# EAGLE design M208X (EAGLE 6.6.0)
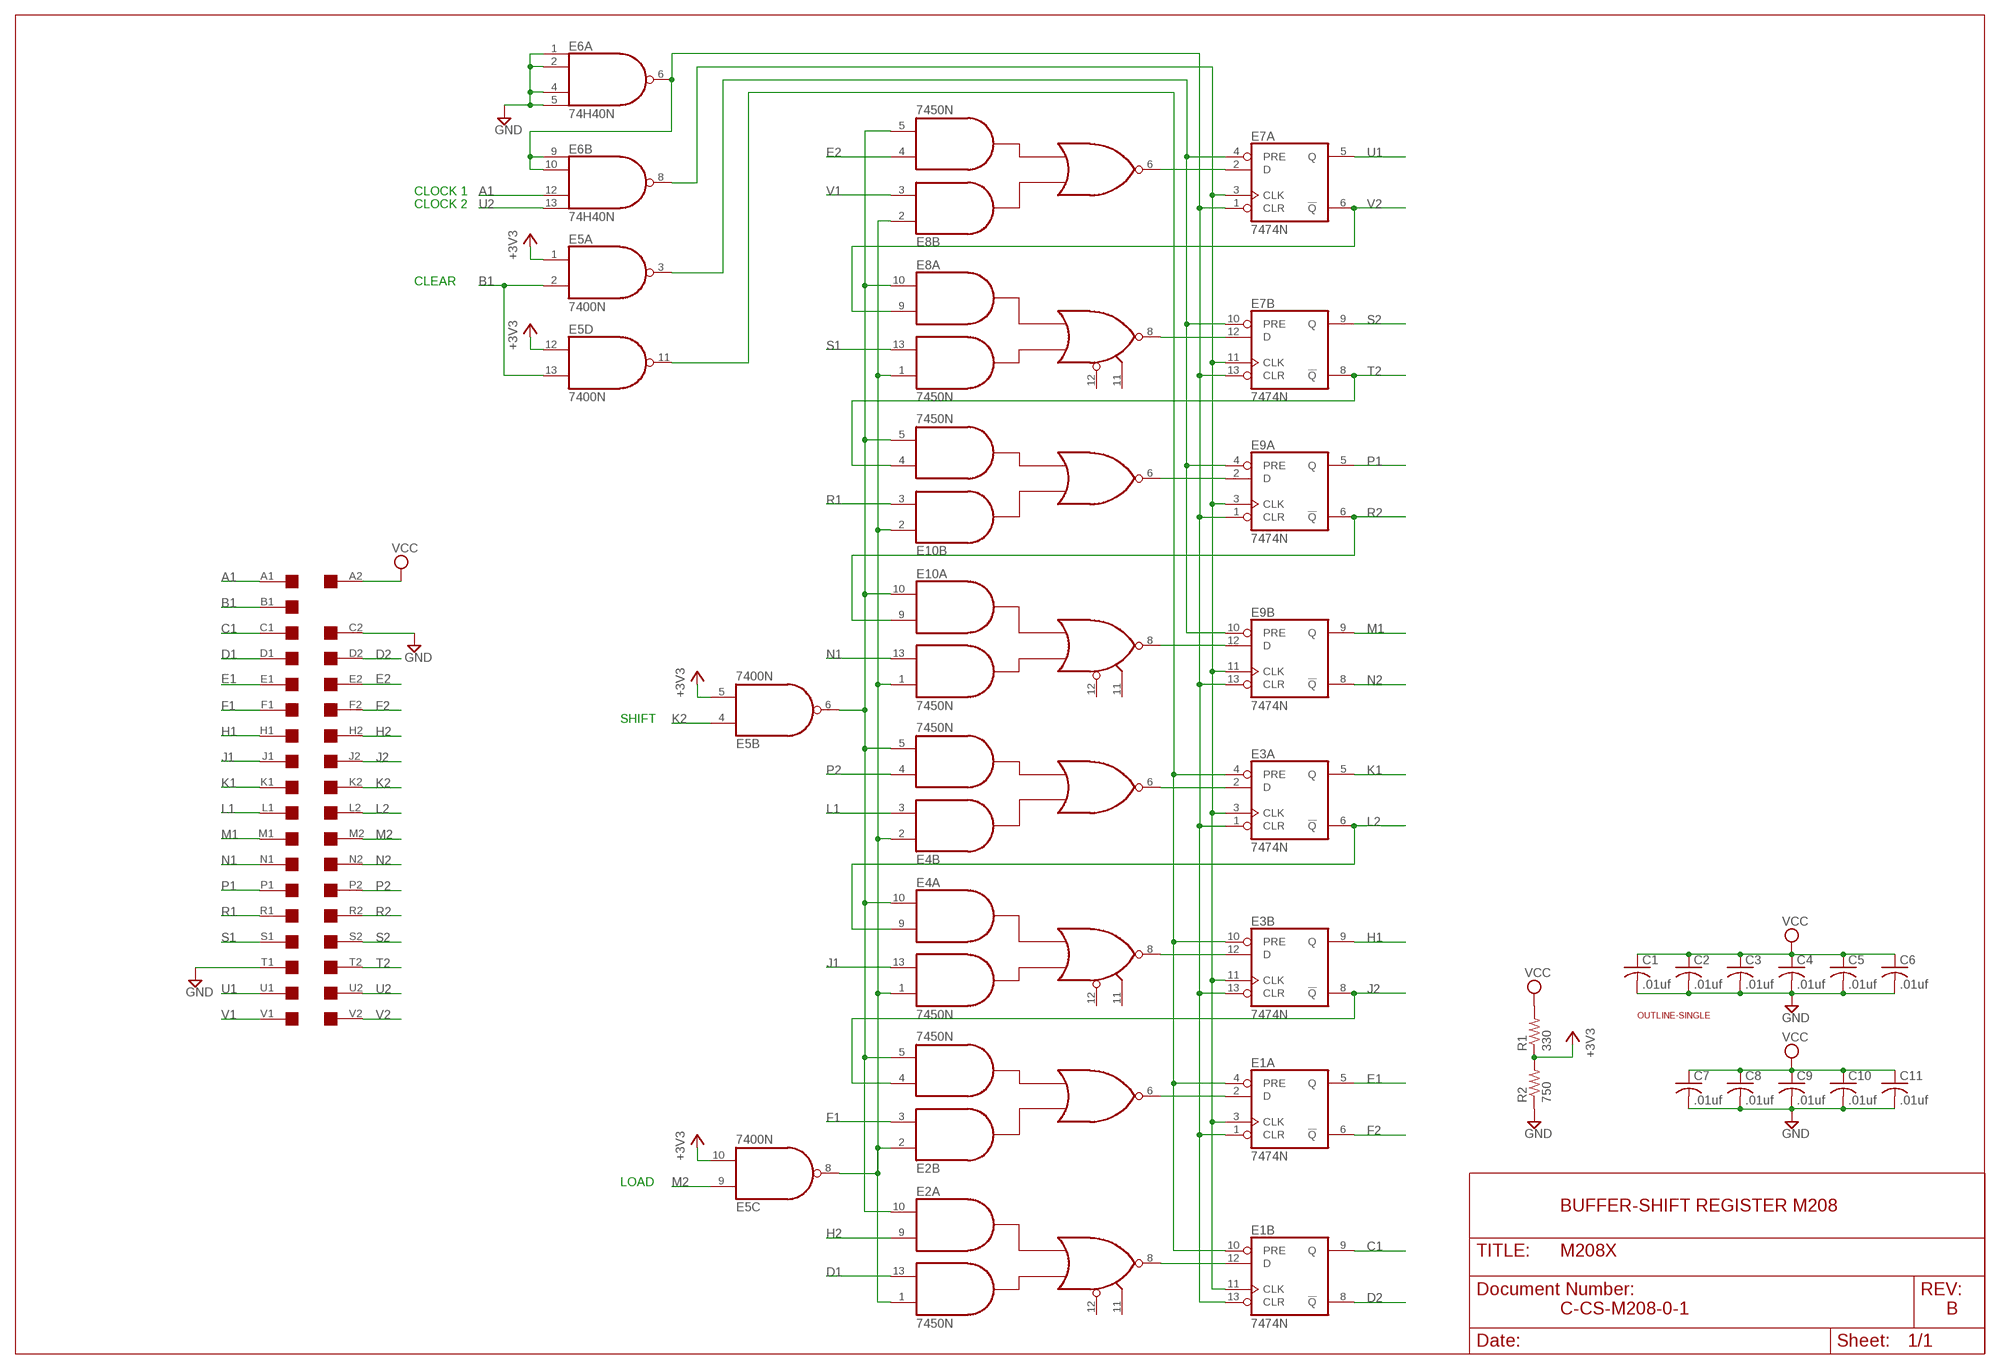
[diagram p0: schematic, sheet 1]

## Parts
C1  .01uf  C-US050-025X075  [C050-025X075]
C2  .01uf  C-US050-025X075  [C050-025X075]
C3  .01uf  C-US050-025X075  [C050-025X075]
C4  .01uf  C-US050-025X075  [C050-025X075]
C5  .01uf  C-US050-025X075  [C050-025X075]
C6  .01uf  C-US050-025X075  [C050-025X075]
C7  .01uf  C-US050-025X075  [C050-025X075]
C8  .01uf  C-US050-025X075  [C050-025X075]
C9  .01uf  C-US050-025X075  [C050-025X075]
C10  .01uf  C-US050-025X075  [C050-025X075]
C11  .01uf  C-US050-025X075  [C050-025X075]
E1  7474N  74S74N  [DIL14]
E2  7450N  [DIL14]
E3  7474N  74S74N  [DIL14]
E4  7450N  [DIL14]
E5  7400N  [DIL14]
E6  74H40N  74S20N  [DIL14]
E7  7474N  74S74N  [DIL14]
E8  7450N  [DIL14]
E9  7474N  74S74N  [DIL14]
E10  7450N  [DIL14]
R1  330  R-US_0207/10  [0207/10]
R2  750  R-US_0207/10  [0207/10]
U$1  SINGLE  [EDGE-CON2]
U$4  OUTLINE-SINGLE  [SINGLE]

## Nets
+3V3: E5.1(A:I0) E5.5(B:I1) E5.10(C:I1) E5.12(D:I0) R1.1 R2.2
A1: E6.12(B:I2) U$1.A1
B1: E5.2(A:I1) E5.13(D:I1) U$1.B1
C1: E1.9(B:Q) U$1.C1
D1: E2.13(A:I3) U$1.D1
D2: E1.8(B:!Q) U$1.D2
E1: E1.5(A:Q) U$1.E1
E2: E8.4(B:I3) U$1.E2
F1: E2.3(B:I2) U$1.F1
F2: E1.6(A:!Q) U$1.F2
GND [Supply]: C1.2 C2.2 C3.2 C4.2 C5.2 C6.2 C7.2 C8.2 C9.2 C10.2 C11.2 E6.1(A:I0) E6.2(A:I1) E6.4(A:I2) E6.5(A:I3) R2.1 U$1.C2 U$1.T1
H1: E3.9(B:Q) U$1.H1
H2: E2.9(A:I2) U$1.H2
J1: E4.13(A:I3) U$1.J1
J2: E2.4(B:I3) E3.8(B:!Q) U$1.J2
K1: E3.5(A:Q) U$1.K1
K2: E5.4(B:I0) U$1.K2
L1: E4.3(B:I2) U$1.L1
L2: E3.6(A:!Q) E4.9(A:I2) U$1.L2
M1: E9.9(B:Q) U$1.M1
M2: E5.9(C:I0) U$1.M2
N1: E10.13(A:I3) U$1.N1
N2: E9.8(B:!Q) U$1.N2
N$1: E7.2(A:D) E8.6(B:O)
N$2: E7.12(B:D) E8.8(A:O)
N$3: E9.2(A:D) E10.6(B:O)
N$4: E9.12(B:D) E10.8(A:O)
N$5: E3.2(A:D) E4.6(B:O)
N$6: E3.12(B:D) E4.8(A:O)
N$7: E1.2(A:D) E2.6(B:O)
N$8: E1.12(B:D) E2.8(A:O)
N$9: E2.1(A:I4) E2.2(B:I1) E4.1(A:I4) E4.2(B:I1) E5.8(C:O) E8.1(A:I4) E8.2(B:I1) E10.1(A:I4) E10.2(B:I1)
N$14: E2.5(B:I4) E2.10(A:I1) E4.5(B:I4) E4.10(A:I1) E5.6(B:O) E8.5(B:I4) E8.10(A:I1) E10.5(B:I4) E10.10(A:I1)
N$27: E1.3(A:CLK) E1.11(B:CLK) E3.3(A:CLK) E3.11(B:CLK) E6.8(B:O) E7.3(A:CLK) E7.11(B:CLK) E9.3(A:CLK) E9.11(B:CLK)
N$29: E1.1(A:CLR) E1.13(B:CLR) E3.1(A:CLR) E3.13(B:CLR) E6.6(A:O) E6.9(B:I0) E6.10(B:I1) E7.1(A:CLR) E7.13(B:CLR) E9.1(A:CLR) E9.13(B:CLR)
N$31: E5.3(A:O) E7.4(A:PRE) E7.10(B:PRE) E9.4(A:PRE) E9.10(B:PRE)
N$32: E1.4(A:PRE) E1.10(B:PRE) E3.4(A:PRE) E3.10(B:PRE) E5.11(D:O)
P1: E9.5(A:Q) U$1.P1
P2: E4.4(B:I3) U$1.P2
R1: E10.3(B:I2) U$1.R1
R2: E9.6(A:!Q) E10.9(A:I2) U$1.R2
S1: E8.13(A:I3) U$1.S1
S2: E7.9(B:Q) U$1.S2
T2: E7.8(B:!Q) E10.4(B:I3) U$1.T2
U1: E7.5(A:Q) U$1.U1
U2: E6.13(B:I3) U$1.U2
V1: E8.3(B:I2) U$1.V1
V2: E7.6(A:!Q) E8.9(A:I2) U$1.V2
VCC [Supply]: C1.1 C2.1 C3.1 C4.1 C5.1 C6.1 C7.1 C8.1 C9.1 C10.1 C11.1 R1.2 U$1.A2
Unconnected: E2.11(A:I6) E2.12(A:I5) E4.11(A:I6) E4.12(A:I5) E8.11(A:I6) E8.12(A:I5) E10.11(A:I6) E10.12(A:I5) U$1.B2

## Notes on the sheet
- CLOCK 1
- CLOCK 2
- CLEAR
- SHIFT
- LOAD
- BUFFER-SHIFT REGISTER M208
- C-CS-M208-0-1 | B

## Power pins joined to a net without a drawn wire
GND: E1.7(P:GND) E2.7(P:GND) E3.7(P:GND) E4.7(P:GND) E5.7(P:GND) E6.7(P:GND) E7.7(P:GND) E8.7(P:GND) E9.7(P:GND) E10.7(P:GND)
VCC: E1.14(P:VCC) E2.14(P:VCC) E3.14(P:VCC) E4.14(P:VCC) E5.14(P:VCC) E6.14(P:VCC) E7.14(P:VCC) E8.14(P:VCC) E9.14(P:VCC) E10.14(P:VCC)

## Library data of the parts
C1-C11 = rcl:C-US: CAPACITOR, American symbol
E1 E3 E7 E9 = 74xx-us:74*74: Dual D type positive edge triggered FLIP FLOP, preset and clear
E2 E4 E8 E10 = dec-con:74*50: 4-2-3-2 input AND OR INVERTER gates
E5 = 74xx-us:74*00: Quad 2-input NAND gate
E6 = 74xx-us:74*20: Dual 4-input NAND gate
R1 R2 = rcl:R-US_: RESISTOR, American symbol
U$1 = dec-con:SINGLE: Single-Height DEC board
U$4 = dec-con:OUTLINE-*: Board outlines for DEC boards.

## Net classes
1 Supply: width 0.813 mm

## Board
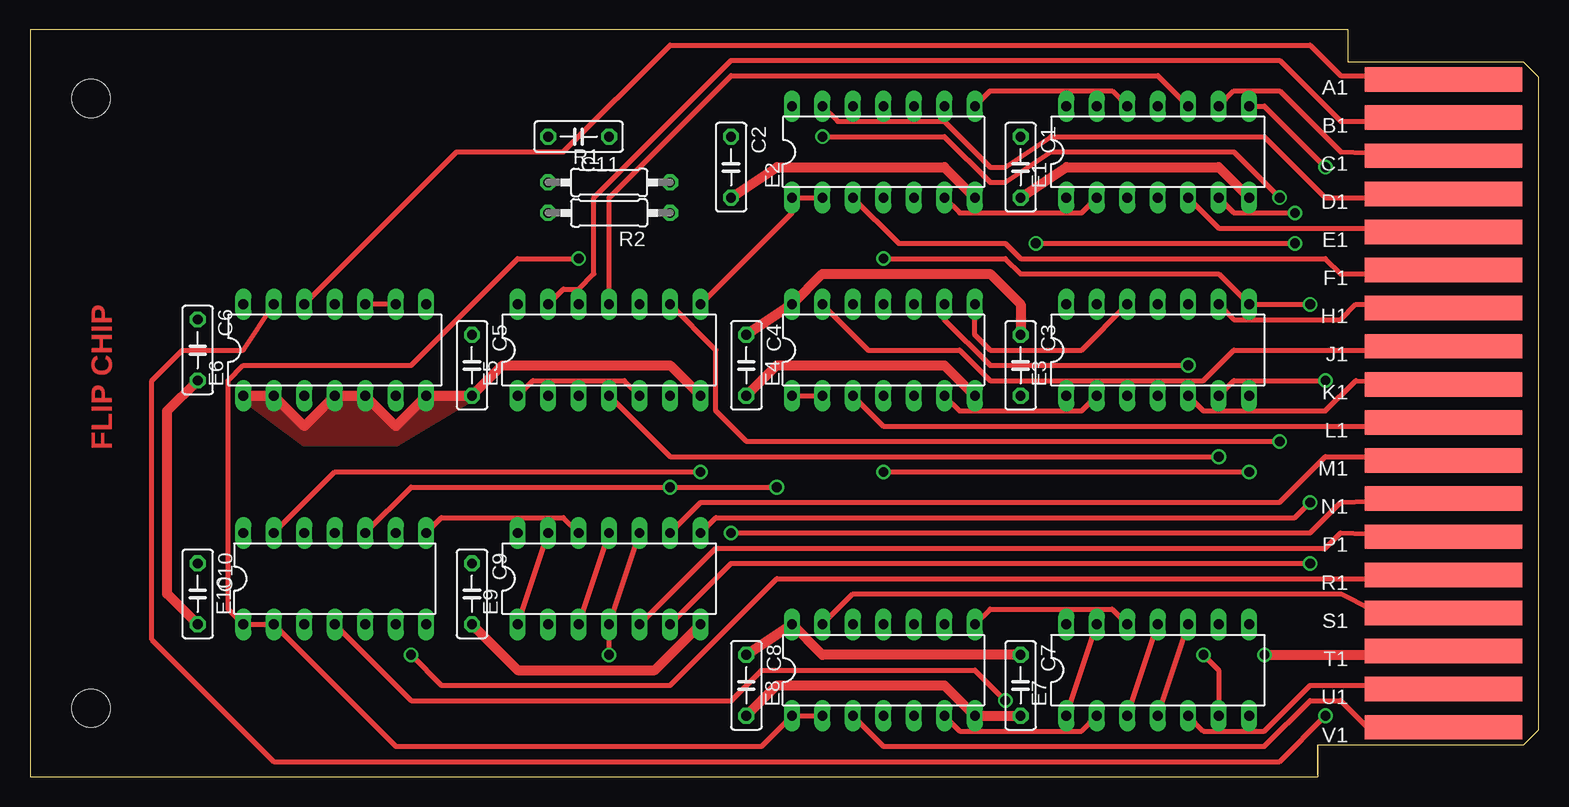
[diagram p1: board, top side]
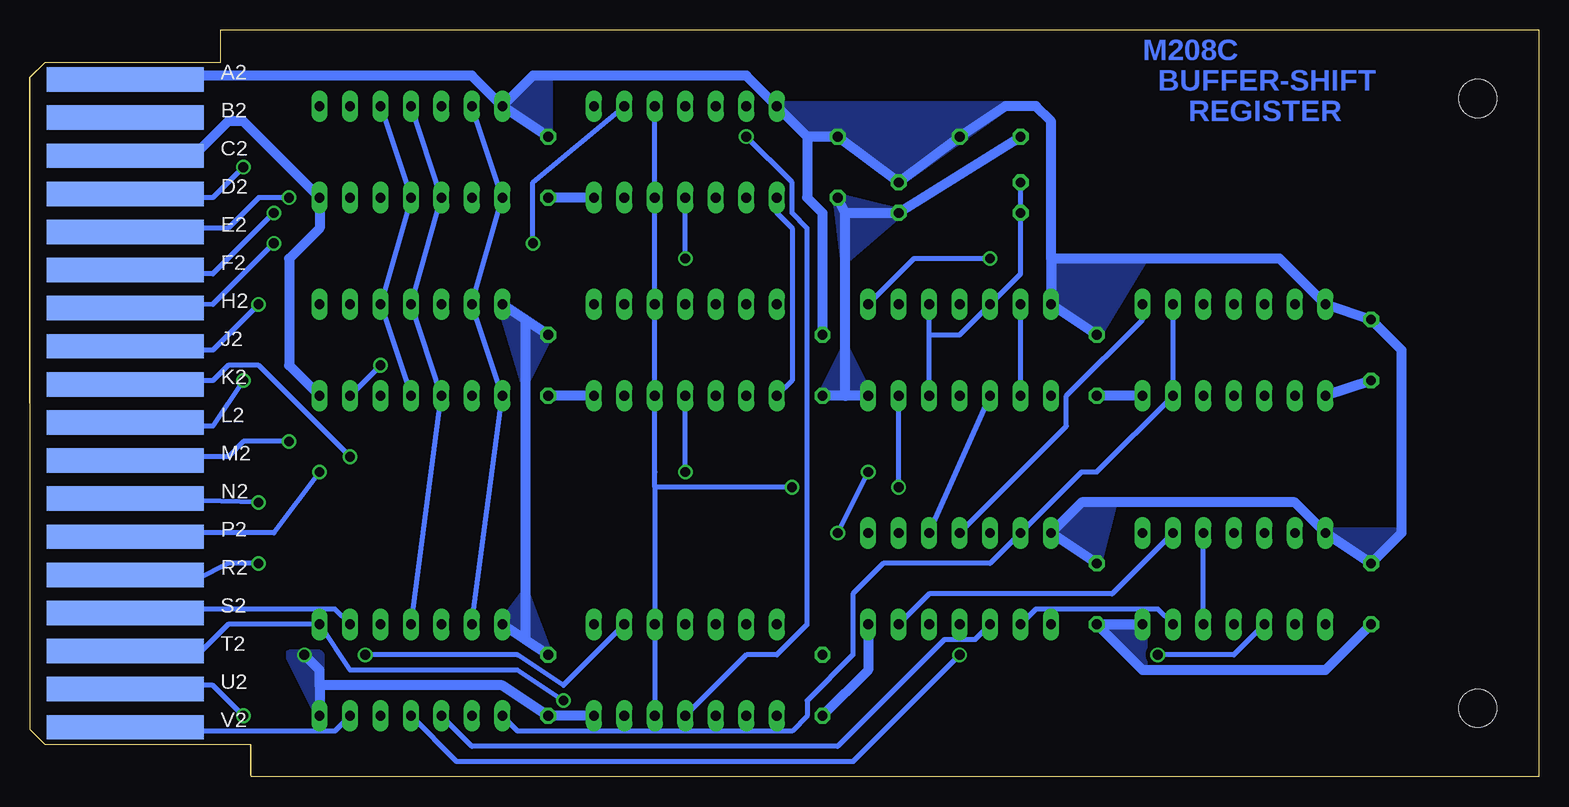
[diagram p2: board, bottom side, seen from below]

Size 125.73 x 62.23 mm. Coordinates in mm from the lower left corner, seen from the top.
Copper layers (1+16): Top 0.035mm / dielectric 1.5mm / Bottom 0.035mm
Design rules "16mils": minimum track width 16mil, minimum drill 32mil, track to track 15mil, track to pad 10mil, pad to pad 10mil, via to via 10mil, smd to smd 10mil, copper to edge 25mil, drill to drill 10mil, minimum pad ring 10mil, minimum via ring 8mil, stop-mask expansion 0mil, vias tented up to drill 0mil, thermal gap 10mil

### Footprints (pad centres in the part's own frame; a part is rotated, then mirrored left to right if it is on the bottom)
C050-025X075 = drill 0.813 octagon: 1 -2.54,0; 2 2.54,0
DIL14 = drill 0.813 long: 1 -7.62,-3.81; 2 -5.08,-3.81; 3 -2.54,-3.81; 4 0,-3.81; 5 2.54,-3.81; 6 5.08,-3.81; 7 7.62,-3.81; 8 7.62,3.81; 9 5.08,3.81; 10 2.54,3.81; 11 0,3.81; 12 -2.54,3.81; 13 -5.08,3.81; 14 -7.62,3.81
0207/10 = drill 0.813 octagon: 1 -5.08,0; 2 5.08,0
EDGE-CON2 = smd 13.106 x 2.032: A1 7.938,4.128; B1 7.938,7.303; C1 7.938,10.477; D1 7.938,13.652; E1 7.938,16.828; F1 7.938,20.003; H1 7.938,23.177; J1 7.938,26.352; K1 7.938,29.527; L1 7.938,32.703; M1 7.938,35.877; N1 7.938,39.053; P1 7.938,42.227; R1 7.938,45.403; S1 7.938,48.578; T1 7.938,51.752; U1 7.938,54.928; V1 7.938,58.102 | smd 13.106 x 2.032 bottom: A2 7.938,4.128; B2 7.938,7.303; C2 7.938,10.477; D2 7.938,13.652; E2 7.938,16.828; F2 7.938,20.003; H2 7.938,23.177; J2 7.938,26.352; K2 7.938,29.527; L2 7.938,32.703; M2 7.938,35.877; N2 7.938,39.053; P2 7.938,42.227; R2 7.938,45.403; S2 7.938,48.578; T2 7.938,51.752; U2 7.938,54.928; V2 7.938,58.102
SINGLE = hole 3.175: 120.65,56.515; 120.65,5.715

### Placement (x,y rotation side)
C1  82.55,50.8 270 top
C2  58.42,50.8 270 top
C3  82.55,34.29 270 top
C4  59.69,34.29 270 top
C5  36.83,34.29 270 top
C6  13.97,35.56 270 top
C7  82.55,7.62 270 top
C8  59.69,7.62 270 top
C9  36.83,15.24 270 top
C10  13.97,15.24 270 top
C11  45.72,53.34 180 top
E1  93.98,52.07 0 top
E2  71.12,52.07 0 top
E3  93.98,35.56 0 top
E4  71.12,35.56 0 top
E5  48.26,35.56 0 top
E6  25.4,35.56 0 top
E7  93.98,8.89 0 top
E8  71.12,8.89 0 top
E9  48.26,16.51 0 top
E10  25.4,16.51 0 top
R1  48.26,49.53 0 top
R2  48.26,46.99 180 top
U$1  125.73,62.23 180 top
U$4  125.73,62.23 180 top

### Tracks (layer width: path | path; a pad name or v marks a point on that pad's centre or on a via)
+3V3
  Top 0.406: E5.1 41.91,33.02 49.53,33.02 E5.5
  Bottom 0.406: 50.8,36.83 48.26,36.83 E5.12 43.18,41.91 R2.2 R1.1 | E5.5 50.8,36.83 | 50.8,36.83 E5.10
A1
  Top 0.406: U$1.A1 117.7,58.42 109.22,58.42 106.68,60.96 53.34,60.96 44.45,52.07 35.56,52.07 E6.12
B1
  Top 0.406: E5.13 44.45,40.64 45.72,40.64 46.99,41.91 46.99,48.26 58.42,59.69 104.14,59.69 109.22,54.61 111.76,54.61 U$1.B1
  Bottom 0.406: E5.2 E5.13
C1
  Top 0.406: U$1.C1 109.22,52.07 104.14,57.15 100.33,57.15 E1.9
D1
  Top 0.406: U$1.D1 111.76,48.26 107.95,48.26 102.87,53.34 85.09,53.34 81.28,50.8 80.01,50.8 76.2,54.61 67.31,54.61 E2.13
D2  (via drill 0.81)
  Top 0.406: v107.95,50.8 102.87,55.88 E1.8
  Bottom 0.406: U$1.D2 111.76,48.26 110.49,48.26 v107.95,50.8
E1
  Top 0.406: U$1.E1 111.76,45.72 99.06,45.72 E1.5
E2  (via drill 0.81)
  Top 0.406: v104.14,48.26 100.33,52.07 85.09,52.07 81.28,49.53 80.01,49.53 76.2,53.34 v66.04,53.34
  Bottom 0.406: E8.4 66.04,10.16 63.5,10.16 60.96,12.7 60.96,45.72 62.23,46.99 62.23,49.53 v66.04,53.34 | U$1.E2 111.76,45.72 109.22,45.72 106.68,48.26 v104.14,48.26
F1
  Top 0.406: U$1.F1 111.76,41.91 109.22,41.91 107.95,43.18 82.55,43.18 81.28,44.45 72.39,44.45 E2.3
F2  (via drill 0.81)
  Top 0.406: E1.6 100.33,46.99 v105.41,46.99
  Bottom 0.406: U$1.F2 111.76,41.91 110.49,41.91 v105.41,46.99
GND  (via drill 0.81)
  Top 0.813: E6.1 E6.2 22.86,29.21 E6.4 E6.5 30.48,29.21 E6.7 C5.2 39.37,34.29 53.34,34.29 E5.7 | C7.2 E8.7 76.2,7.62 62.23,7.62 C8.2 | U$1.T1 111.76,10.16 v102.87,10.16 | E1.7 99.06,50.8 86.36,50.8 C1.2 | E2.7 76.2,50.8 62.23,50.8 C2.2 | C4.2 62.23,34.29 76.2,34.29 E4.7 | C10.2 11.43,15.24 11.43,30.48 C6.2 | E9.7 52.07,8.89 40.64,8.89 C9.2
  Bottom 0.813: 101.6,7.62 E7.7 | 101.6,7.62 101.6,8.89 v102.87,10.16 | 101.6,7.62 86.36,7.62 C7.2 E8.7 | U$1.C2 112.09,51.74 109.22,54.61 107.95,54.61 E1.7 101.6,45.72 104.14,43.18 104.14,34.29 E3.7 | E2.7 C1.2 | E5.7 57.78,31.75 | 57.78,31.75 C4.2 | 57.78,46.99 R2.1 C11.2 | 57.78,46.99 C2.2 | 57.78,31.75 57.78,46.99 | C10.2 17.78,8.89 33.02,8.89 C9.2 E10.7 | C8.2 55.88,8.89 E9.7 | E4.7 C3.2 | C6.2 E6.1 | E6.7 C5.2
  pour Bottom (no thermals): 101.6,5.08 101.6,10.16 104.14,10.16
  pour Bottom (no thermals): 58.42,48.26 53.34,46.99 57.78,43.18
  pour Bottom (no thermals): 55.88,31.75 59.69,31.75 57.78,35.56
  pour Bottom (no thermals): 33.02,8.89 33.02,12.7 36.83,12.7
  pour Top (no thermals): 17.78,31.75 22.86,27.94 30.48,27.94 36.83,31.75 33.02,31.75 30.48,29.21 27.94,31.75 25.4,31.75 22.86,29.21 20.32,31.75
H1
  Top 0.406: U$1.H1 111.76,39.37 110.49,39.37 109.22,38.1 100.33,38.1 E3.9
H2  (via drill 0.81)
  Top 0.406: v83.82,44.45 v105.41,44.45
  Bottom 0.406: E2.9 83.82,49.53 v83.82,44.45 | U$1.H2 110.49,39.37 v105.41,44.45
J1
  Top 0.406: U$1.J1 111.76,35.56 100.33,35.56 97.79,33.02 80.01,33.02 77.47,35.56 69.85,35.56 E4.13
J2  (via drill 0.81)
  Top 0.406: v71.12,43.18 81.28,43.18 82.55,41.91 99.06,41.91 E3.8 v106.68,39.37
  Bottom 0.406: v71.12,43.18 E2.4 | U$1.J2 111.76,35.56 110.49,35.56 v106.68,39.37
K1
  Top 0.406: E3.5 97.79,30.48 107.95,30.48 110.49,33.02 U$1.K1
K2  (via drill 0.81)
  Top 0.406: E5.4 53.34,26.67 v99.06,26.67
  Bottom 0.406: v99.06,26.67 106.68,34.29 109.22,34.29 110.49,33.02 111.76,33.02 U$1.K2
L1
  Top 0.406: E4.3 71.12,29.21 111.76,29.21 U$1.L1
L2  (via drill 0.81)
  Top 0.406: E4.9 76.2,38.1 80.01,34.29 v96.52,34.29 | E3.6 100.33,33.02 v107.95,33.02
  Bottom 0.406: v96.52,34.29 E3.6 | v107.95,33.02 110.49,29.21 111.76,29.21 112.09,29.54 U$1.L2
M1
  Top 0.406: U$1.M1 111.76,26.67 107.95,26.67 104.14,22.86 55.88,22.86 E9.9
M2  (via drill 0.81)
  Top 0.406: E5.9 57.15,35.56 57.15,30.48 59.69,27.94 v104.14,27.94
  Bottom 0.406: U$1.M2 111.76,26.67 109.22,26.67 107.95,27.94 v104.14,27.94
N1  (via drill 0.81)
  Top 0.406: E10.13 25.4,25.4 v55.88,25.4 | U$1.N1 109.22,22.86 106.68,20.32 v58.42,20.32
  Bottom 0.406: v55.88,25.4 v58.42,20.32
N2  (via drill 0.81)
  Top 0.406: v106.68,22.86 105.41,21.59 57.15,21.59 E9.8
  Bottom 0.406: v106.68,22.86 U$1.N2
N$1
  Top 0.406: E8.6 77.47,3.81 87.63,3.81 E7.2
N$2
  Top 0.406: E7.12 90.17,13.97 80.01,13.97 E8.8
N$3
  Bottom 0.406: E10.6 31.75,13.97 41.91,13.97 E9.2
N$4
  Top 0.406: E10.8 34.29,21.59 44.45,21.59 E9.12
N$5
  Top 0.406: E3.2 87.63,30.48 77.47,30.48 E4.6
N$6
  Top 0.406: E4.8 78.74,36.83 80.01,35.56 87.63,35.56 E3.12
N$7
  Top 0.406: E1.2 87.63,46.99 77.47,46.99 E2.6
N$8
  Top 0.406: E1.12 90.17,57.15 80.01,57.15 E2.8
N$9  (via drill 0.81)
  Top 0.406: E8.2 E8.1 60.96,2.54 30.48,2.54 E10.2 E10.1 16.51,13.97 16.51,33.02 17.78,34.29 31.75,34.29 40.64,43.18 v45.72,43.18 | E2.2 E2.1 63.5,46.99 E5.8 | E4.1 E4.2
  Bottom 0.406: E5.8 52.07,43.18 v45.72,43.18 | E4.1 62.23,33.02 62.23,45.72 63.5,46.99 E2.1
N$14  (via drill 0.81)
  Top 0.406: E10.10 31.75,24.13 v53.34,24.13 v62.23,24.13
  Bottom 0.406: E2.10 E2.5 E4.10 E4.5 73.66,25.4 73.66,24.13 | E8.5 E8.10 73.66,24.13 | E10.5 E10.10 | v53.34,24.13 E5.6 | v62.23,24.13 73.66,24.13
N$27
  Top 0.406: E7.3 E7.11 | E9.3 E9.11
  Bottom 0.406: E7.11 E3.3 E3.11 E1.3 E1.11 | E9.3 46.99,11.43 49.53,11.43 58.42,2.54 88.9,2.54 E7.3 | E6.8 33.02,38.1 39.37,31.75 39.37,29.21 E9.11
N$29
  Top 0.406: E7.1 E7.13 | E9.1 E9.13 | E6.9 E6.10
  Bottom 0.406: E7.13 E3.1 E3.13 E1.1 E1.13 | E6.9 E6.6 36.83,25.4 38.1,25.4 E9.13 45.72,17.78 54.61,17.78 57.15,15.24 57.15,10.16 60.96,6.35 60.96,5.08 62.23,3.81 85.09,3.81 E7.1
N$31  (via drill 0.81)
  Top 0.406: v48.26,10.16 E9.4 E9.10 | E7.4 E7.10
  Bottom 0.406: E9.10 E5.3 | v48.26,10.16 57.15,1.27 90.17,1.27 E7.4
N$32
  Top 0.406: E5.11 48.26,48.26 58.42,58.42 93.98,58.42 E1.10
  Bottom 0.406: E3.4 E3.10 E1.4 E1.10
P1
  Top 0.406: U$1.P1 109.22,20.32 107.95,19.05 57.15,19.05 E9.5
P2  (via drill 0.81)
  Top 0.406: v71.12,25.4 v101.6,25.4
  Bottom 0.406: v71.12,25.4 E4.4 | U$1.P2 111.76,20.32 105.41,20.32 v101.6,25.4
R1  (via drill 0.81)
  Top 0.406: U$1.R1 112.09,16.84 111.76,16.51 62.23,16.51 53.34,7.62 34.29,7.62 v31.75,10.16
  Bottom 0.406: v31.75,10.16 25.4,10.16 E10.3
R2  (via drill 0.81)
  Top 0.406: v106.68,17.78 58.42,17.78 E9.6
  Bottom 0.406: E10.9 35.56,15.24 50.8,15.24 E9.6 | U$1.R2 111.76,16.51 109.22,17.78 v106.68,17.78
S1
  Top 0.406: U$1.S1 112.06,13.66 111.76,13.97 109.22,15.24 68.58,15.24 E8.13
S2
  Bottom 0.406: U$1.S2 111.76,13.97 100.33,13.97 E7.9
T2  (via drill 0.81)
  Top 0.406: E10.4 31.75,6.35 58.42,6.35 60.96,8.89 78.74,8.89 v81.28,6.35
  Bottom 0.406: U$1.T2 111.76,10.16 109.22,12.7 E7.8 99.06,8.89 85.09,8.89 v81.28,6.35
U1
  Top 0.406: U$1.U1 112.12,7.26 111.76,7.62 106.68,7.62 102.87,3.81 97.79,3.81 E7.5
U2  (via drill 0.81)
  Top 0.406: v107.95,5.08 104.14,1.27 20.32,1.27 10.16,11.43 10.16,33.02 12.7,35.56 17.78,35.56 E6.13
  Bottom 0.406: U$1.U2 112.12,7.26 111.76,7.62 110.49,7.62 v107.95,5.08
V1
  Top 0.406: U$1.V1 111.76,3.81 109.22,6.35 106.68,6.35 102.87,2.54 71.12,2.54 E8.3
V2  (via drill 0.81)
  Top 0.406: v97.79,10.16 99.06,8.89 E7.6
  Bottom 0.406: U$1.V2 112.15,4.2 111.76,3.81 100.33,3.81 E7.6 | E8.9 81.28,7.62 85.09,10.16 v97.79,10.16
VCC
  Top 0.813: C8.1 E8.14 66.04,10.16 C7.1 | C4.1 E4.14 66.04,41.91 80.01,41.91 82.55,39.37 C3.1
  Bottom 0.813: 84.45,11.43 C7.1 | 84.45,11.43 E7.14 | C3.1 84.45,38.1 | 84.45,38.1 E3.14 | 84.45,38.1 84.45,11.43 | U$1.A2 111.76,58.42 88.9,58.42 E1.14 | E1.14 C1.1 | 60.33,53.34 C2.1 R1.2 C11.1 44.45,55.88 41.91,55.88 40.64,54.61 40.64,43.18 | 60.33,53.34 60.96,53.34 | 60.96,53.34 E2.14 66.04,58.42 83.82,58.42 E1.14 | 40.64,43.18 E5.14 C5.1 | 40.64,43.18 21.59,43.18 E6.14 C6.1 11.43,35.56 11.43,20.32 C10.1 E10.14 20.32,22.86 38.1,22.86 E9.14 C9.1 | 60.33,53.34 60.96,53.34 | 60.96,53.34 60.96,48.26 60.33,47.62 59.69,46.99 C4.1
  pour Bottom (no thermals): 13.97,17.78 11.43,20.32 17.78,20.32
  pour Bottom (no thermals): 36.83,17.78 40.64,20.32 38.1,22.86 35.56,22.86
  pour Bottom (no thermals): 82.55,10.16 84.45,15.24 86.36,12.7
  pour Bottom (no thermals): 82.55,36.83 84.45,33.02 86.36,39.37
  pour Bottom (no thermals): 86.36,55.88 82.55,53.34 82.55,58.42 83.82,58.42
  pour Bottom (no thermals): 63.5,55.88 60.96,53.34 58.42,53.34 53.34,49.53 44.45,55.88
  pour Bottom (no thermals): 36.83,36.83 40.64,39.37 40.64,43.18 33.02,43.18

### Text on the board
Top: FLIP CHIP
Bottom: M208C | BUFFER-SHIFT | REGISTER